# EAGLE design Motor_Shield (EAGLE 7.4.0)
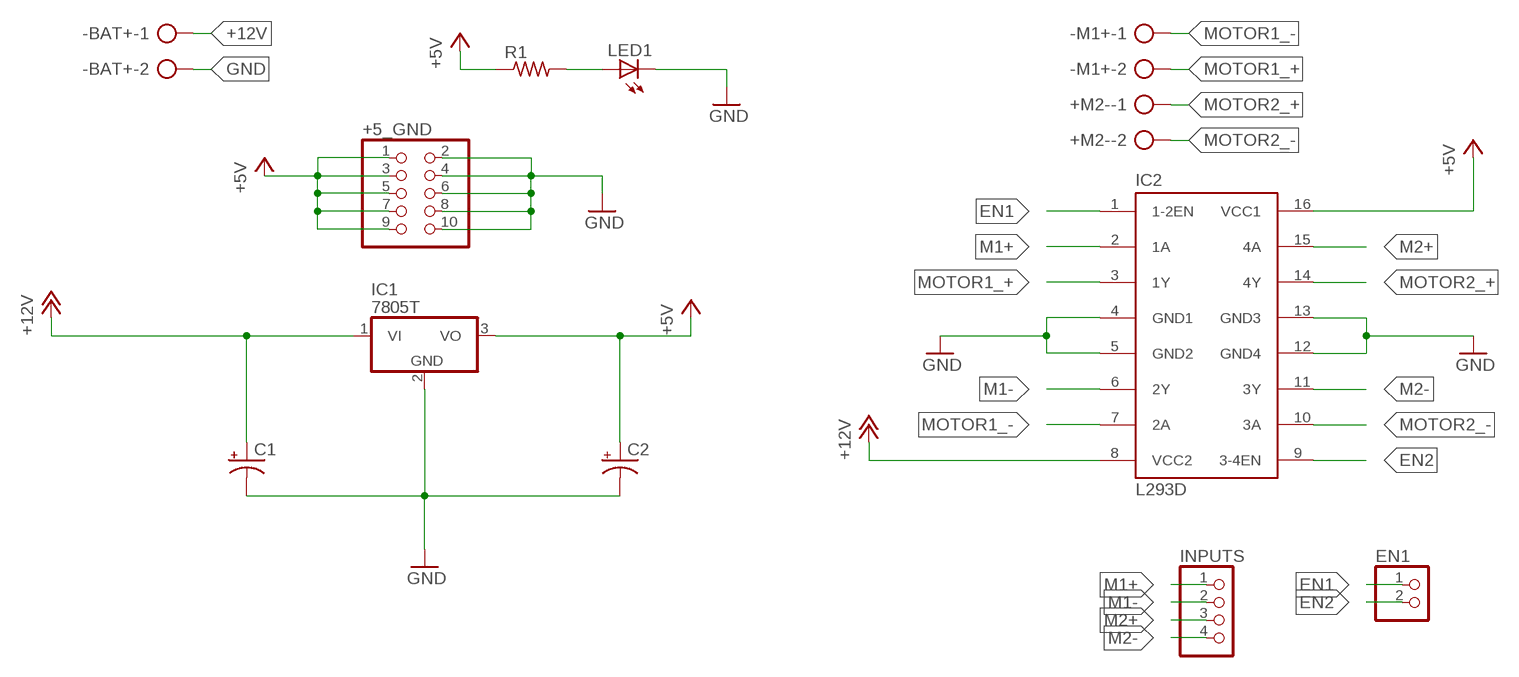
[diagram p0: schematic, sheet 1]

## Parts
+5_GND  PINHD-2X5  [2X05]
+M2-  AK500/2-H  [AK500/2-H]
-BAT+  AK500/2-H  [AK500/2-H]
-M1+  AK500/2-H  [AK500/2-H]
C1  CPOL-USB45181A  [B45181A]
C2  CPOL-USB45181A  [B45181A]
EN1  PINHD-1X2  [1X02]
IC1  7805T  [TO220H]
IC2  L293D  [DIL16]
INPUTS  PINHD-1X4  [1X04]
LED1  LED5MM  [LED5MM]
R1  R-US_0309/12  [0309/12]

## Nets
+5V [+5V]: +5_GND.1 +5_GND.3 +5_GND.5 +5_GND.7 +5_GND.9 C2.+ IC1.3(VO) IC2.16(VCC1) R1.1
+12V [+12V]: -BAT+.1 C1.+ IC1.1(VI) IC2.8(VCC2)
EN1: EN1.1 IC2.1(1-2EN)
EN2: EN1.2 IC2.9(3-4EN)
GND [GND]: +5_GND.2 +5_GND.4 +5_GND.6 +5_GND.8 +5_GND.10 -BAT+.2 C1.- C2.- IC1.2(GND) IC2.4(GND1) IC2.5(GND2) IC2.12(GND4) IC2.13(GND3) LED1.K(C)
M1+: IC2.2(1A) INPUTS.1
M1-: IC2.6(2Y) INPUTS.2
M2+: IC2.15(4A) INPUTS.3
M2-: IC2.11(3Y) INPUTS.4
MOTOR1_+ [Motor]: -M1+.2 IC2.3(1Y)
MOTOR1_- [Motor]: -M1+.1 IC2.7(2A)
MOTOR2_+ [Motor]: +M2-.1 IC2.14(4Y)
MOTOR2_- [Motor]: +M2-.2 IC2.10(3A)
N$1: LED1.A R1.2

## Library data of the parts
+5_GND = pinhead:PINHD-2X5: PIN HEADER
+M2- -BAT+ -M1+ = con-ptr500:AK500/2-H: CONNECTOR Aug. 2004 / PTR Meßtechnik: Die Bezeichnung der Serie AK505 wurde geändert. Es handelt sich hierbei um AK500 in horizontaler Ausführung.; OC_FARNELL: unknown; OC_NEWARK: unknown
C1 C2 = adafruit:CPOL-US: POLARIZED CAPACITOR, American symbol
EN1 = pinhead:PINHD-1X2: PIN HEADER
IC1 = adafruit:78*: Positive VOLTAGE REGULATOR Added bigger pads to the TO-92 package
IC2 = st-microelectronics:L293D: PUSH-PULL 4 CHANNEL DRIVER; MPN: L293D; OC_FARNELL: 9589619; OC_NEWARK: 56P8249
INPUTS = pinhead:PINHD-1X4: PIN HEADER
LED1 = adafruit:LED: LED OSRAM: - CHIPLED LG R971, LG N971, LY N971, LG Q971, LY Q971, LO R971, LY R971 LH N974, LH R974 LS Q976, LO Q976, LY Q976 LO Q996 - Hyper CHIPLED LW Q18S LB Q993, LB Q99A, LB R99A - SideLED LS A670, LO A670, LY A670, LG A670, LP A670 LB A673, LV A673, LT A673, LW A673 LH A674 LY A675 LS A676, LA A676, LO A676, LY A676, LW A676 LS A679, LY A679, LG A679 - Hyper Micro SIDELED® LS Y876, LA Y876, LO Y876, LY Y876 LT Y87S - SmartLED LW L88C, LW L88S LB L89C, LB L89S, LG L890 LS L89K, LO L89K, LY L89K LS L896, LA L896, LO L896, LY L896 - TOPLED LS T670, LO T670, LY T670, LG T670, LP T670 LSG T670, LSP T670, LSY T670, LOP T670, LYG T670 LG T671, LOG T671, LSG T671 LB T673, LV T673, LT T673, LW T673 LH T674 LS T676, LA T676, LO T676, LY T676, LB T676, LH T676, LSB T676, LW T676 LB T67C, LV T67C, LT T67C, LS T67K, LO T67K, LY T67K, LW E67C LS E67B, LA E67B, LO E67B, LY E67B, LB E67C, LV E67C, LT E67C LW T67C LS T679, LY T679, LG T679 LS T770, LO T770, LY T770, LG T770, LP T770 LB T773, LV T773, LT T773, LW T773 LH T774 LS E675, LA E675, LY E675, LS T675 LS T776, LA T776, LO T776, LY T776, LB T776 LHGB T686 LT T68C, LB T68C - Hyper Mini TOPLED® LB M676 - Mini TOPLED Santana® LG M470 LS M47K, LO M47K, LY M47K Source: http://www.osram.convergy.de/
R1 = rcl:R-US_: RESISTOR, American symbol

## Net classes
0 default: width 0.254 mm, clearance 0.508 mm
1 GND: width 1.27 mm, drill 1.27 mm, clearance 0.508 mm
2 +5V: width 0.762 mm, drill 0.762 mm, clearance 0.508 mm
3 Motor: width 0.635 mm, drill 0.635 mm, clearance 0.508 mm
4 +12V: width 1.27 mm, drill 1.27 mm, clearance 0.508 mm

## Board
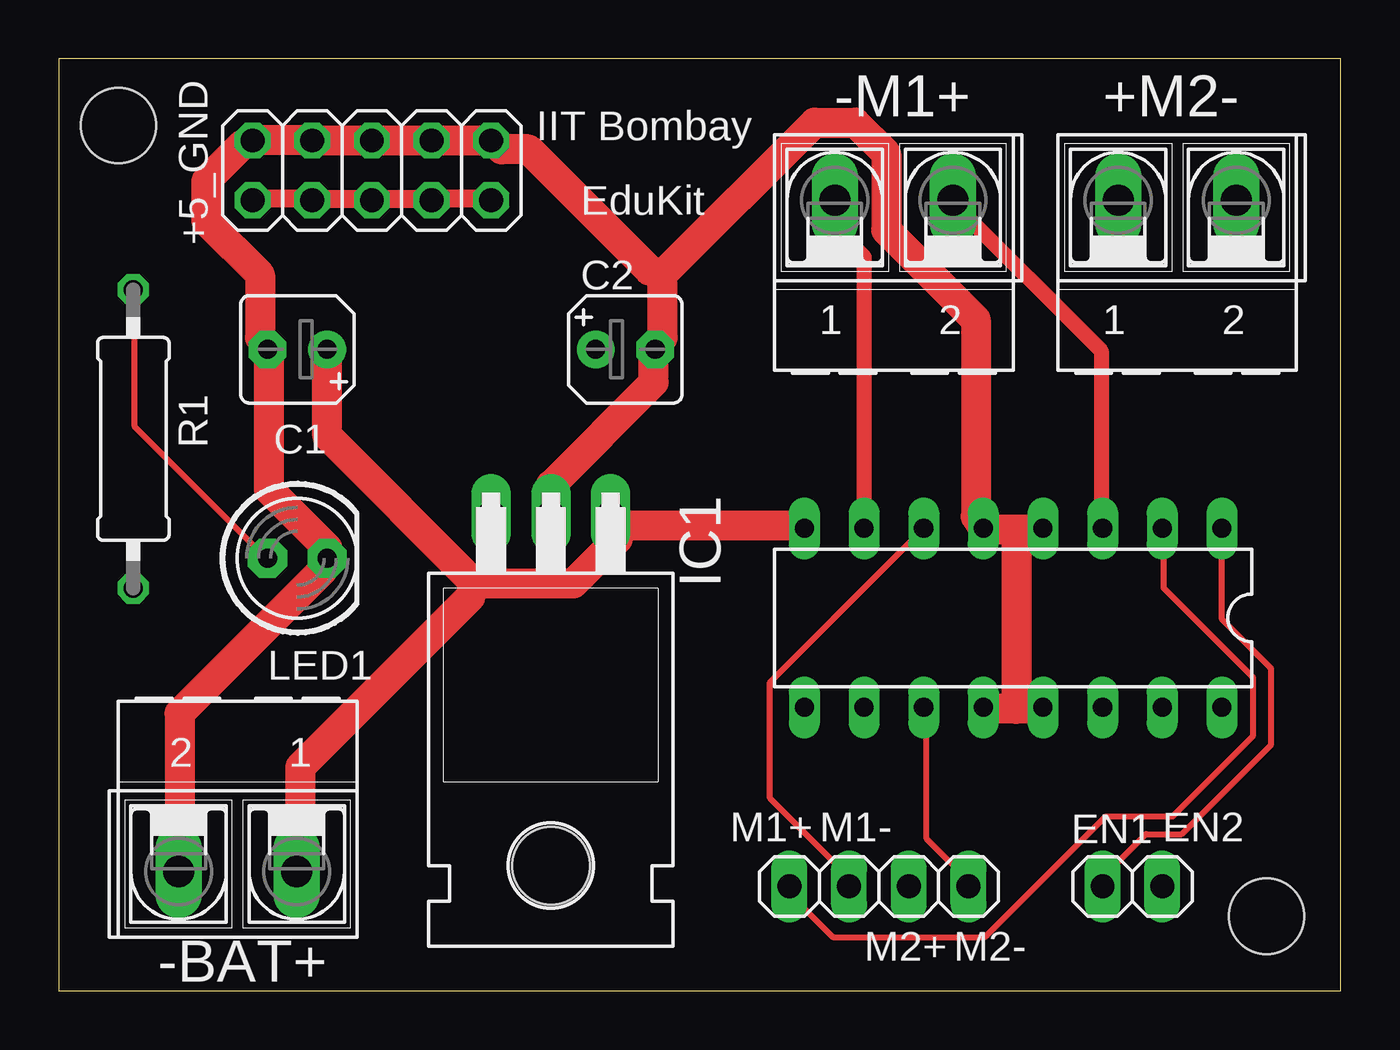
[diagram p1: board, top side]
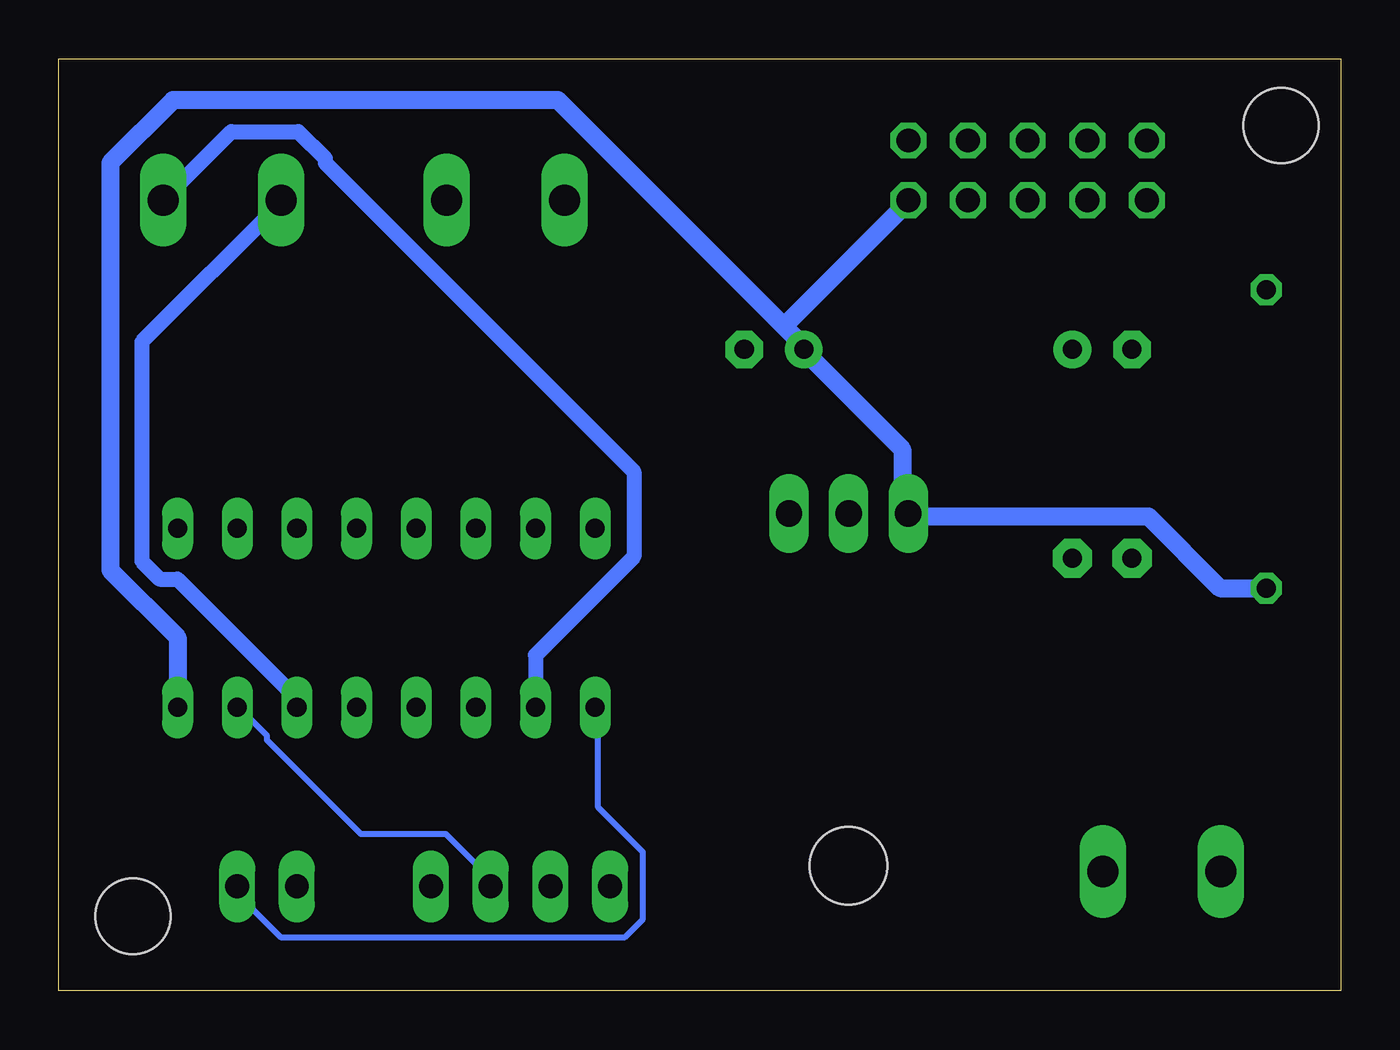
[diagram p2: board, bottom side, seen from below]

Size 54.59 x 39.67 mm. Coordinates in mm from the lower left corner, seen from the top.
Outline: 0,0 54.59,0 54.59,39.67 0,39.67 0,0
Copper layers (1*16): Top 0.035mm / dielectric 1.5mm / Bottom 0.035mm
Design rules "default": minimum track width 10mil, minimum drill 24mil, track to track 8mil, track to pad 8mil, pad to pad 8mil, via to via 8mil, smd to smd 8mil, copper to edge 40mil, drill to drill 8mil, minimum pad ring 10mil, minimum via ring 8mil, stop-mask expansion 4mil, vias tented up to drill 0mil, thermal gap 10mil
Holes 3.2 mm at 2.54,36.83 51.44,3.17

### Footprints (pad centres in the part's own frame; a part is rotated, then mirrored left to right if it is on the bottom)
2X05 = drill 1.016 octagon: 1 -5.08,-1.27; 2 -5.08,1.27; 3 -2.54,-1.27; 4 -2.54,1.27; 5 0,-1.27; 6 0,1.27; 7 2.54,-1.27; 8 2.54,1.27; 9 5.08,-1.27; 10 5.08,1.27
AK500/2-H = drill 1.321 long: 1 -2.515,0; 2 2.515,0
B45181A = drill 0.813 pad 1.6: + -1.27,0 | drill 0.813 pad 1.6 octagon: - 1.27,0
1X02 = drill 1.016 long: 1 -1.27,0; 2 1.27,0
TO220H = drill 1.118 long: 1 -2.54,-10.16; 2 0,-10.16; 3 2.54,-10.16 | hole 3.302: 0,4.826
DIL16 = drill 0.813 long: 1 -8.89,-3.81; 2 -6.35,-3.81; 3 -3.81,-3.81; 4 -1.27,-3.81; 5 1.27,-3.81; 6 3.81,-3.81; 7 6.35,-3.81; 8 8.89,-3.81; 9 8.89,3.81; 10 6.35,3.81; 11 3.81,3.81; 12 1.27,3.81; 13 -1.27,3.81; 14 -3.81,3.81; 15 -6.35,3.81; 16 -8.89,3.81
1X04 = drill 1.016 long: 1 -3.81,0; 2 -1.27,0; 3 1.27,0; 4 3.81,0
LED5MM = drill 0.813 pad 1.676 octagon: A -1.27,0; K 1.27,0
0309/12 = drill 0.813 octagon: 1 -6.35,0; 2 6.35,0

### Placement (x,y rotation side)
+5_GND  13.34,34.92 0 top
+M2-  47.62,33.66 0 top
-BAT+  7.62,5.08 180 top
-M1+  35.56,33.66 0 top
C1  10.16,27.3 180 top
C2  24.13,27.3 0 top
EN1  45.72,4.45 0 top
IC1  20.95,10.16 180 top
IC2  40.64,15.88 180 top
INPUTS  34.92,4.45 0 top
LED1  10.16,18.41 0 top
R1  3.17,23.5 90 top

### Tracks (layer width: path | path; a pad name or v marks a point on that pad's centre or on a via)
+5V
  Top 0.762: +5_GND.9 18.29,33.72 16,33.72 +5_GND.7 15.62,33.72 13.53,33.72 +5_GND.5 13.34,33.72 11.05,33.72 +5_GND.3 10.67,33.72 8.38,33.72 +5_GND.1
  Bottom 0.762: R1.1 5.14,17.14 8.19,20.19 18.29,20.19 IC1.3 18.67,20.57 18.67,23.05 22.67,27.05 C2.+ 22.86,27.43 23.72,28.29 | IC2.16 49.53,15.05 52.39,17.91 52.39,35.24 49.72,37.91 33.34,37.91 23.72,28.29 | 23.72,28.29 18.48,33.53 +5_GND.9
+12V
  Top 1.27: IC2.8 31.62,19.81 24,19.81 IC1.1 23.81,19.24 21.91,17.34 17.72,17.34 | C1.+ 11.43,23.62 17.72,17.34 | -BAT+.1 10.29,5.14 10.29,9.53 17.53,16.76 17.72,17.34
EN1
  Top 0.254: IC2.1 49.53,15.81 51.63,13.72 51.63,10.48 47.82,6.67 46.29,6.67 44.58,4.95 44.58,4.57 EN1.1
EN2
  Bottom 0.254: IC2.9 31.62,12 31.62,7.81 29.72,5.91 29.72,3.05 30.48,2.29 45.15,2.29 46.86,4 46.86,4.38 EN1.2
GND
  Top 1.27: -BAT+.2 5.14,5.14 5.14,11.81 11.24,17.91 LED1.K 11.43,18.86 8.95,21.34 8.95,27.24 C1.- 8.57,27.81 8.57,30.48 6.29,32.77 6.29,34.48 7.81,36.01 +5_GND.2 +5_GND.4 +5_GND.6 +5_GND.8 +5_GND.10 18.86,35.81 20,35.81 25.15,30.67 25.72,30.48 | 40.77,12 41.91,12 IC2.13 | 40.77,12 39.43,12 IC2.12 | 40.77,19.62 41.91,19.62 IC2.4 | 40.77,19.62 39.43,19.62 IC2.5 39.05,20.19 39.05,28.57 35.24,32.38 35.24,35.62 33.91,36.96 32.19,36.96 25.72,30.48 | 40.77,19.62 40.77,12 | IC1.2 20.95,21.53 25.34,25.91 25.34,27.24 C2.- 25.72,27.81 25.72,30.48
M1+
  Top 0.254: IC2.2 47.05,19.62 47.05,17.14 50.86,13.34 50.86,10.86 47.43,7.43 44.58,7.43 39.43,2.29 32.96,2.29 31.24,4 31.24,4.38 INPUTS.1
M1-
  Top 0.254: IC2.6 30.29,13.14 30.29,8.19 33.53,4.95 33.53,4.57 INPUTS.2
M2+
  Bottom 0.254: INPUTS.3 36.2,4.76 38.1,6.67 41.72,6.67 45.72,10.67 45.72,10.86 46.86,12 IC2.15
M2-
  Top 0.254: IC2.11 36.96,12 36.96,6.48 38.86,4.57 INPUTS.4
MOTOR1_+
  Top 0.635: IC2.3 44.39,19.81 44.39,27.24 38.1,33.53 -M1+.2
MOTOR1_-
  Top 0.635: IC2.7 34.29,31.24 33.15,32.38 33.15,33.53 -M1+.1
MOTOR2_+
  Bottom 0.635: IC2.14 44.58,12.19 44.58,12.57 49.53,17.53 50.29,17.53 51.05,18.29 51.05,27.62 45.15,33.53 +M2-.1
MOTOR2_-
  Bottom 0.635: IC2.10 34.29,14.29 30.1,18.48 30.1,22.1 43.24,35.24 43.24,35.43 44.39,36.58 47.24,36.58 50.1,33.72 +M2-.2
N$1
  Top 0.254: R1.2 3.24,29.72 3.24,24 8.76,18.48 LED1.A

### Text on the board
tNames: IIT Bombay | EduKit | M1+ | M1- | EN2 | M2+ | M2-